# Altium schematic sheet OUT.SchDoc
size A4; SheetNumber: 2; SheetTotal: 4
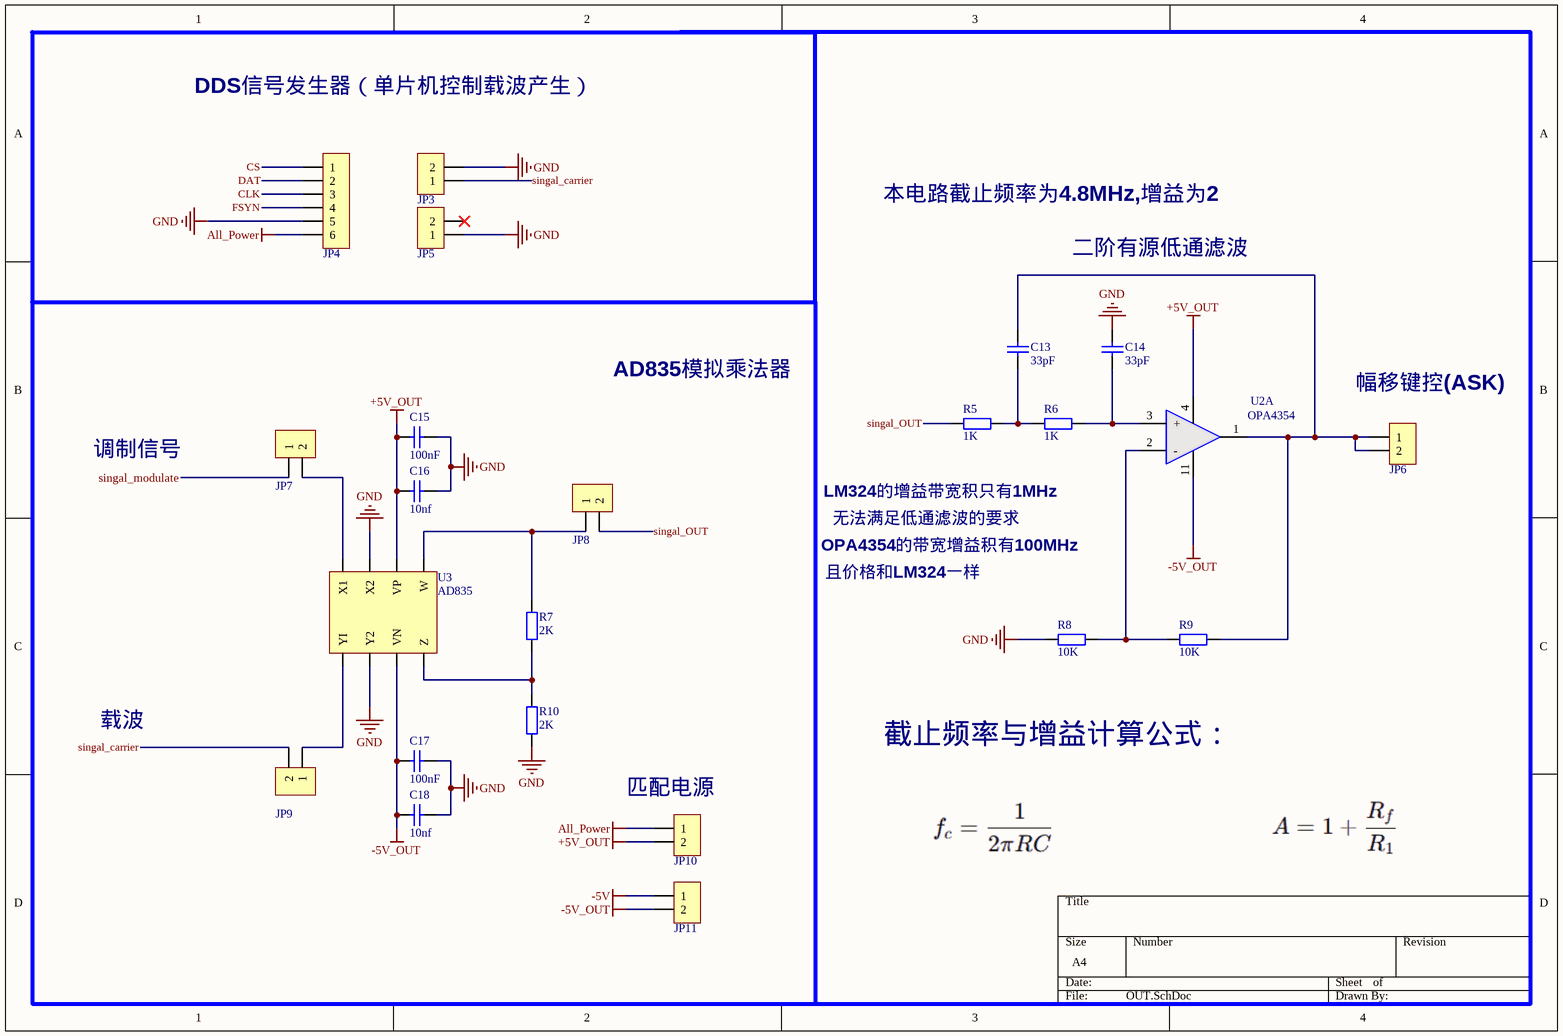
[diagram p0: OUT.SchDoc]

## Parts
C13  33pF  [C0603_M]
C14  33pF  [C0603_M]
C15  100nF  [C0603_M]
C16  10nf  [C0603_M]
C17  100nF  [C0603_M]
C18  10nf  [C0603_M]
JP3  HDR-1X2  [HDR2.54-M-LI-2P]  (value not drawn)
JP4  HDR-1X6  [HDR2.54-M-LI-6P]  (value not drawn)
JP5  HDR-1X2  [HDR2.54-M-LI-2P]  (value not drawn)
JP6  HDR-1X2  [HDR2.54-LI-2P]  (value not drawn)
JP7  HDR-1X2  [HDR2.54-LI-2P]  (value not drawn)
JP8  HDR-1X2  [HDR2.54-LI-2P]  (value not drawn)
JP9  HDR-1X2  [HDR2.54-LI-2P]  (value not drawn)
JP10  HDR-1X2  [HDR2.54-LI-2P]  (value not drawn)
JP11  HDR-1X2  [HDR2.54-LI-2P]  (value not drawn)
R5  1K  [R0603_M]
R6  1K  [R0603_M]
R7  2K  [R0603_M]
R8  10K  [R0603_M]
R9  10K  [R0603_M]
R10  2K  [R0603_M]
U2  OPA4354  [SOP14_M]  (part A of 4)
U3  AD835  [SOP8_L]

## Nets
+5V_OUT: C15.1 C16.2 JP10.2 U2.4(V+) U3.6(VP)
-5V: JP11.1
-5V_OUT: C17.1 C18.2 JP11.2 U2.11(V-) U3.3(VN)
All_Power: JP4.6 JP10.1
GND: C14.2 C15.2 C16.1 C17.2 C18.1 JP3.2 JP4.5 JP5.1 R8.2 R10.1 U3.2(Y2) U3.7(X2)
CLK: JP4.3
CS: JP4.1
DAT: JP4.2
FSYN: JP4.4
singal_carrier: JP3.1 JP9.2
singal_modulate: JP7.1
singal_OUT: JP8.2 R5.1
NetC13_1: C13.1 R5.2 R6.1
NetC13_2: C13.2 JP6.1 JP6.2 R9.2 U2.1(OUT)
NetC14_1: C14.1 R6.2 U2.3(+)
NetJP7_2: JP7.2 U3.8(X1)
NetJP8_1: JP8.1 R7.1 U3.5(W)
NetJP9_1: JP9.1 U3.1(YI)
NetR7_2: R7.2 R10.2 U3.4(Z)
NetR8_1: R8.1 R9.1 U2.2(-)

Not connected (* = marked no-connect by the designer): JP5 2*

## Notes on the sheet
- DDS信号发生器（单片机控制载波产生）
- 本电路截止频率为4.8MHz,增益为2
- 二阶有源低通滤波
- AD835模拟乘法器
- (near JP6) 幅移键控(ASK)
- 调制信号
- 无法满足低通滤波的要求
- LM324的增益带宽积只有1MHz
- 且价格和LM324一样
- OPA4354的带宽增益积有100MHz
- 载波
- 截止频率与增益计算公式：
- (near JP10) 匹配电源

## Library data of the parts
C13-C15 C17 = C: 贴片电容/MLCC电容; BOM名称: 无极性贴片电容; 当前库版本V2022.11.14 @淘宝卖家:黄晶宝石: 最新版本发布https://shop463601444.taobao.com
C16 C18 = C_3: 贴片电容; BOM名称: 无极性贴片电容; 联系卖家，免费查找封装: 唯一出售店铺网址https://shop463601444.taobao.com
JP3 JP5-JP9 = Header 2: 2P接插件; 版权归属: 封装库来自淘宝 ID：黄晶宝石; BOM名称: 2P接插件
JP4 = Header 6: 6P接插件; 学习资源: 最新版本发布https://item.taobao.com/item.htm?id=566775463719; 版权归属: 封装库来自淘宝 ID：黄晶宝石; BOM名称: 6P接插件
JP10 JP11 = Header 2: 2P接插件; 联系卖家，免费查找封装: 唯一出售店铺网址https://shop463601444.taobao.com; 封装库来自淘宝卖家ID：黄晶宝石: 其他店铺购入均为盗版封装库，请立即申请退款，本店现金奖励50~200元; BOM名称: 2P接插件
R5-R10 = R: 贴片电阻; 联系下单店铺卖家 免费帮你查找封装: 联系下单店铺卖家 免费技术支持; BOM名称: 贴片电阻
U2 = LM324: 4运放
U3 = AD835ARZ: 四象限模拟乘法器